# Altium schematic sheet ERBB.SchDoc
size A
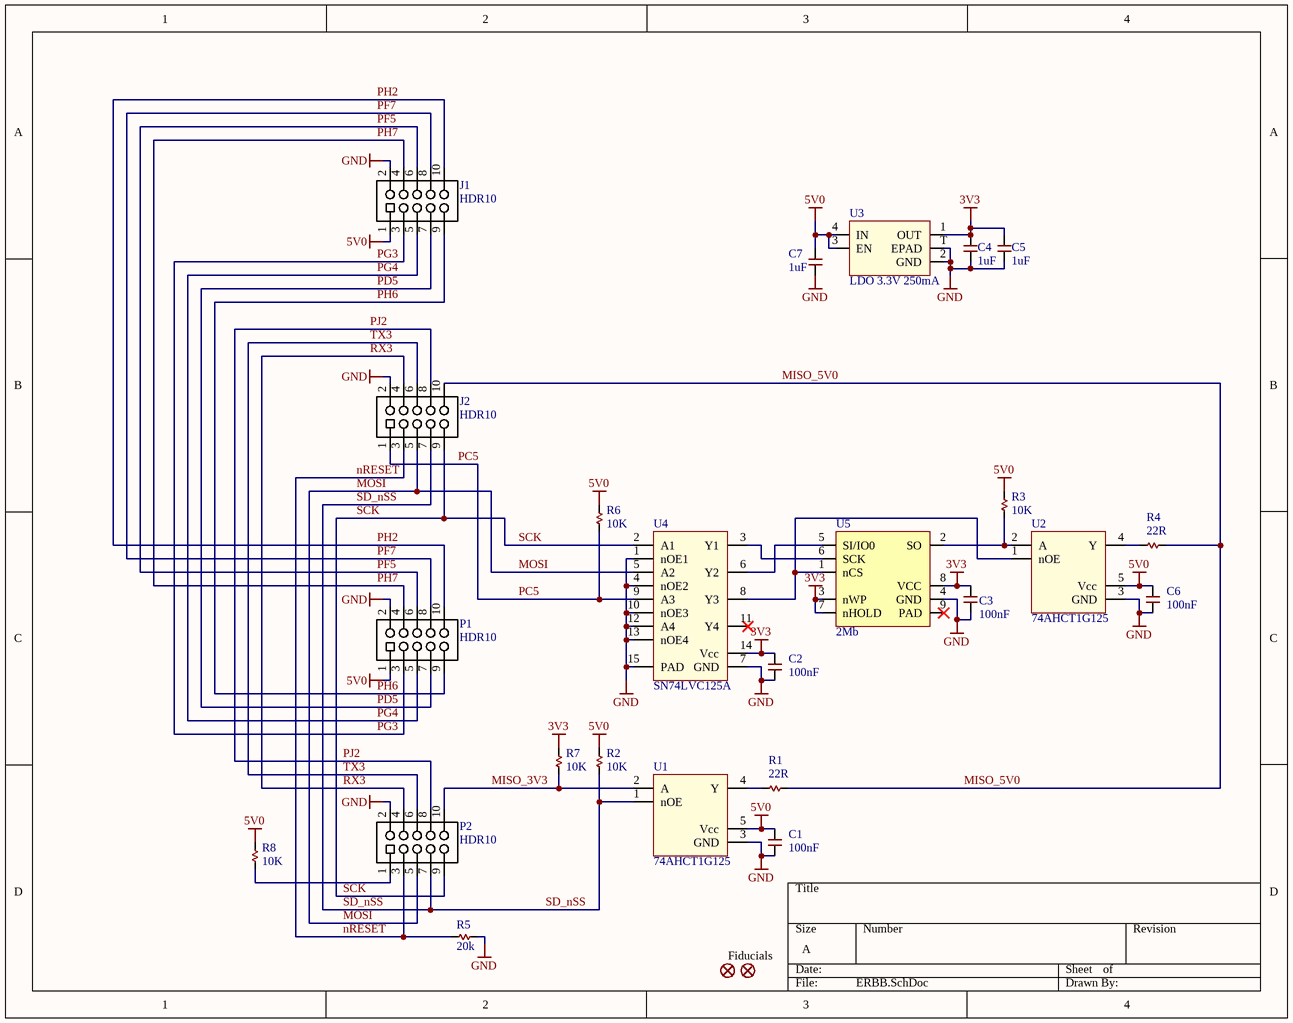
[diagram p0: ERBB.SchDoc]

## Parts
C1  100nF  [C0402]
C2  100nF  [C0402]
C3  100nF  [C0402]
C4  1uF  [C0402]
C5  1uF  [C0402]
C6  100nF  [C0402]
C7  1uF  [C0402]
FID1  FIDUCIAL  [FIDUCIAL-1X2]  (value not drawn)
FID2  FIDUCIAL  [FIDUCIAL-1X2]  (value not drawn)
J1  HDR10  [HDR2X5_PLUG]
J2  HDR10  [HDR2X5_PLUG]
P1  HDR10  [HDR2X5 IDC]
P2  HDR10  [HDR2X5 IDC]
R1  22R  [R0402]
R2  10K  [R0402]
R3  10K  [R0402]
R4  22R  [R0402]
R5  20k  [R0402]
R6  10K  [R0402]
R7  10K  [R0402]
R8  10K  [R0402]
U1  74AHCT1G125  [SOTFL50P160X60-5L]
U2  74AHCT1G125  [SOTFL50P160X60-5L]
U3  LDO 3.3V 250mA  [XDFN4 1X1]
U4  SN74LVC125A  [PVQFN14_3.5X3.5]
U5  2Mb  [USON8 2X3]

## Nets
3V3: C2.1 C3.2 C4.2 C5.2 R7.1 U3.1(OUT) U4.14(Vcc) U5.3(nWP) U5.7(nHOLD) U5.8(VCC)
5V0: C1.2 C6.2 C7.2 J1.1 P1.1 R2.1 R3.1 R6.1 R8.1 U1.5(Vcc) U2.5(Vcc) U3.3(EN) U3.4(IN)
GND: C1.1 C2.2 C3.1 C4.1 C5.1 C6.1 C7.1 J1.2 J2.2 P1.2 P2.2 R5.2 U1.3(GND) U2.3(GND) U3.2(GND) U3.T(EPAD) U4.1(nOE1) U4.4(nOE2) U4.7(GND) U4.10(nOE3) U4.12(A4) U4.13(nOE4) U4.15(PAD) U5.4(GND)
MISO_3V3: P2.10 R7.2 U1.2(A)
MISO_5V0: J2.10 R1.2 R4.2
MOSI: J2.5 P2.5 U4.5(A2)
nRESET: J2.3 P2.3 R5.1
PC5: J2.1 R6.2 U4.9(A3)
PD5: J1.7 P1.7
PF5: J1.6 P1.6
PF7: J1.8 P1.8
PG3: J1.3 P1.3
PG4: J1.5 P1.5
PH2: J1.10 P1.10
PH6: J1.9 P1.9
PH7: J1.4 P1.4
PJ2: J2.8 P2.8
RX3: J2.4 P2.4
SCK: J2.9 P2.9 U4.2(A1)
SD_nSS: J2.7 P2.7 R2.2 U1.1(nOE)
TX3: J2.6 P2.6
NetP2_1: P2.1 R8.2
NetR1_1: R1.1 U1.4(Y)
NetR3_2: R3.2 U2.2(A) U5.2(SO)
NetR4_1: R4.1 U2.4(Y)
NetU2_1: U2.1(nOE) U4.8(Y3) U5.1(nCS)
NetU4_3: U4.3(Y1) U5.6(SCK)
NetU4_6: U4.6(Y2) U5.5(SI/IO0)

Not connected (* = marked no-connect by the designer): U1 23(NC); U2 23(NC); U4 11(Y4)* 23(NC); U5 9(PAD)*

## Notes on the sheet
- Fiducials

## Library data of the parts
C1-C3 C6 = 100nF 0402 16V X7R: CAP CER 0402 100nF 16V 10% X7R; MANUFACTURER: Murata; MANUFACTURER #: GRM155R71C104KA88D; PART: 0.1uF 16V X7R 0402; PART DESCRIPTION: 0.10µF ±10% 16V Ceramic Capacitor X7R 0402 (1005 Metric); VALUE: 100nF; DISTRIBUTOR #: 490-3261-2-ND; DISTRIBUTOR: Digikey; TOLERANCE: 10%; EE_SPEC: 16V
C4 C5 C7 = 1uF 0402 6.3V X5R: CAP CER 0402 1uF 6.3V 10% X5R; MANUFACTURER: Murata; MANUFACTURER #: GRM155R60J105KE19D; PART: 1uF 6.3V X5R 0402; PART DESCRIPTION: 1µF ±10% 6.3V Ceramic Capacitor X5R 0402 (1005 Metric); DISTRIBUTOR #: 490-1320-2-ND; DISTRIBUTOR: Digikey; TOLERANCE: 10%; EE_SPEC: 6.3V; VALUE: 1uF
J1 J2 = Header FM 10PIN 2ROW T-HOLE VERT: CONN FM HEADER VERT 10POS GOLD; MANUFACTURER #: 2214S-10SG-85; MANUFACTURER: Multicomp; PART DESCRIPTION: 2.54mm pitch, double row PCB socket; TOLERANCE: -NA-; DISTRIBUTOR #: 08N6807; DISTRIBUTOR: Newark; PART: HDR10; VALUE: HDR10; EE_SPEC: -NA-
P1 P2 = Header 10PIN 2ROW T-HOLE VERT SHROUDED: CONN HEADER VERT 10POS GOLD; MANUFACTURER #: 302-S101; MANUFACTURER: On Shore; PART DESCRIPTION: 10 Positions Header Connector 0.100" (2.54mm) Through Hole Gold; TOLERANCE: -NA-; DISTRIBUTOR #: ED1543-ND; DISTRIBUTOR: Digikey; PART: HDR10; VALUE: HDR10; EE_SPEC: -NA-
R1 R4 = 22R 1% 0402: RES 0402 22r 62.5mW 1%; Manufacturer: Yageo; MANUFACTURER #: RC0402FR-0722RL; Part Description: 22 Ohm ±1% 0.063W, 1/16W Chip Resistor 0402 (1005 Metric) Moisture Resistant Thick Film; Tolerance: +/- 1%; DISTRIBUTOR #: 311-22.0LRTR-ND; DISTRIBUTOR: Digi-Key; EE_SPEC: 22R 1% 0402; PART: 22R; VALUE: 22R
R2 R3 R6-R8 = 10k 1% 0402: RES SMD 10K OHM 1% 1/16W 0402; MANUFACTURER: Yageo; MANUFACTURER #: RC0402FR-0710KP; PART DESCRIPTION: 10k Ohm ±1% 0.063W, 1/16W Chip Resistor 0402 (1005 Metric) Moisture Resistant Thick Film; DISTRIBUTOR #: YAG1249TR-ND; DISTRIBUTOR: Digikey; PART: 10k 1% 0402; TOLERANCE: 1%; EE_SPEC: 1/16W; VALUE: 10K
R5 = 20k 1% 0402: RES SMD 20K OHM 1% 1/16W 0402; MANUFACTURER: Yageo; MANUFACTURER #: RC0402FR-0720KL; PART DESCRIPTION: 20k Ohm ±1% 0.063W, 1/16W Chip Resistor 0402 (1005 Metric) Moisture Resistant Thick Film; DISTRIBUTOR #: 311-20.0KLRTR-ND; DISTRIBUTOR: Digikey; PART: RES SMD 20K OHM 1% 1/16W 0402; TOLERANCE: 1%; EE_SPEC: 1/16W; VALUE: 20k
U1 U2 = SN74AHCT1G125DRLR: IC BUS BUFF TRI-ST N-INV  SOT-553; MANUFACTURER: TI; PART DESCRIPTION: Buffer, Non-Inverting 1 Element 1 Bit per Element Push-Pull Output SOT-5; TOLERANCE: -NA-; EE_SPEC: 4.5-5.5V; MANUFACTURER #: SN74AHCT1G125DRLR; DISTRIBUTOR #: 296-19379-2-ND; DISTRIBUTOR: Digikey; PART: SN74AHCT1G125DRLR; VALUE: 74AHCT1G125
U3 = LDO 3.3V 250mA: IC REG LINEAR 3.3V 250MA 4XDFN; MANUFACTURER #: NCP160AMX330TBG; MANUFACTURER: On Semi; PART DESCRIPTION: Linear Voltage Regulator IC Positive Fixed 1 Output 3.3V 250mA 4-XDFN (1x1); TOLERANCE: -NA-; DISTRIBUTOR #: NCP160AMX330TBGOSTR-ND; DISTRIBUTOR: Digikey; PART: IC REG LINEAR 3.3V 250MA 4XDFN; VALUE: LDO 3.3V 250mA; EE_SPEC: 250mA
U4 = SN74LVC125A: IC BUS BUFF TRI-ST QD 14VQFN; MANUFACTURER #: SN74LVC125ARGYR; MANUFACTURER: TI; PART DESCRIPTION: Buffer, Non-Inverting 4 Element 1 Bit per Element Push-Pull Output 14-VQFN (3.5x3.5); TOLERANCE: -NA-; EE_SPEC: 1.65-3.6Vcc, 5V tolerant inputs; DISTRIBUTOR #: 296-13961-2-ND; DISTRIBUTOR: Digikey; PART: IC BUS BUFF TRI-ST QD 14VQFN; VALUE: SN74LVC125A
U5 = W25X20CL: IC FLASH 2MBIT 104MHZ 8USON; MANUFACTURER #: W25X20CLUXIG TR; MANUFACTURER: Winbond; PART DESCRIPTION: FLASH Memory IC 2Mb (256K x 8) SPI 104MHz 8-USON (2x3); TOLERANCE: -NA-; EE_SPEC: 3.3V; DISTRIBUTOR #: W25X20CLUXIGTR-ND; DISTRIBUTOR: Digikey; PART: IC FLASH 2MBIT 104MHZ 8USON; VALUE: 2Mb